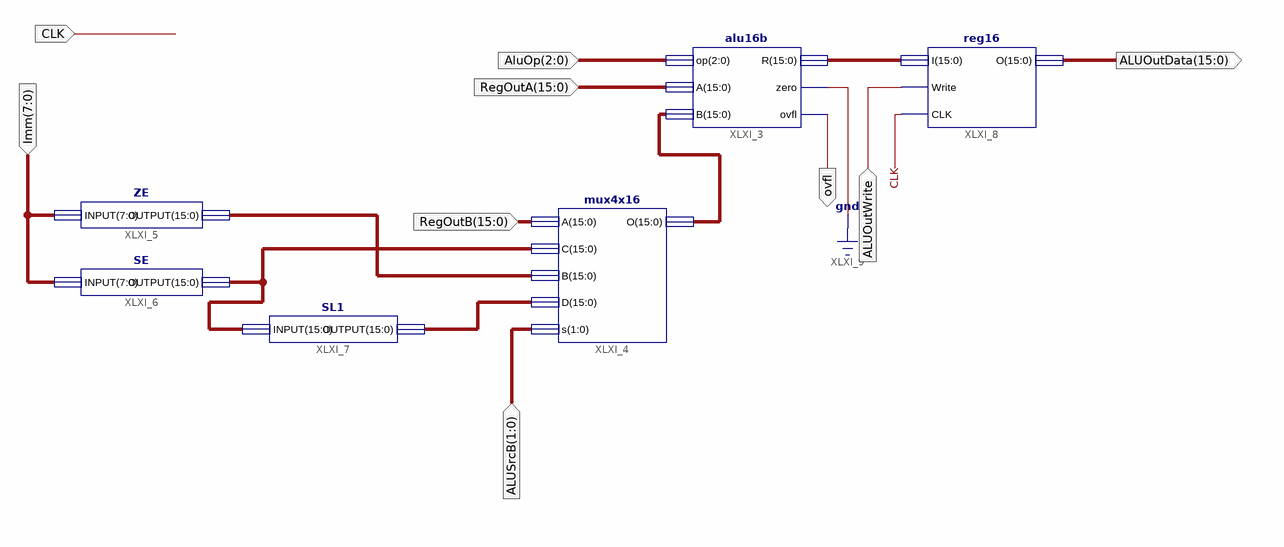
[diagram p0: schematic sheet 1]
// Xilinx ISE schematic AluTest.sch (spartan3e) as structural Verilog: 6 symbols, 9 ports
module AluTest (
  input  [15:0] RegOutB,
  input  [7:0] Imm,
  input  [1:0] ALUSrcB,
  input  [2:0] AluOp,
  input  [15:0] RegOutA,
  input  CLK,
  input  ALUOutWrite,
  output ovfl,
  output [15:0] ALUOutData
);

  wire [15:0] XLXN_1, XLXN_15, XLXN_16, XLXN_18, XLXN_24;

  alu16b XLXI_3 (.A(RegOutA), .B(XLXN_1), .op(AluOp), .ovfl(ovfl), .R(XLXN_24), .zero(1'b0));
  mux4x16 XLXI_4 (.A(RegOutB), .C(XLXN_16), .B(XLXN_15), .D(XLXN_18), .s(ALUSrcB), .O(XLXN_1));
  ZE XLXI_5 (.INPUT(Imm), .OUTPUT(XLXN_15));
  SE XLXI_6 (.INPUT(Imm), .OUTPUT(XLXN_16));
  SL1 XLXI_7 (.INPUT(XLXN_16), .OUTPUT(XLXN_18));
  reg16 XLXI_8 (.I(XLXN_24), .Write(ALUOutWrite), .CLK(CLK), .O(ALUOutData));
endmodule
